# Altium schematic sheet SAMV71_Xplained_Ultra_Power_Multiplexer.SchDoc: Power Multiplexer
size A3; Organization: ATMEL Norway; Address1: Vestre Rosten 79; Address2: N-7075 TILLER; Address3: NORWAY; DocumentNumber: A09-2407; Revision: 11; SheetNumber: 3; SheetTotal: 13; DrawnBy: Microchip Norway; Engineer: AH; PageSetup: Record=PageOptions|CenterHorizontal=True|CenterVertical=True|PrintScale=1.01|XCorrection=1.00|YCorrection=1.00|PrintKind=1|BorderSize=5000000|LeftOffset=0|BottomOffset=0|Orientation=2|PaperLength=1000|PaperWidth=1000|Scale=100|PaperSource=7|PrintQuality=-4|MediaType=1|DitherType=10|PaperKind=A3 (297 x 420 mm)|PrintScaleMode=1; ProjectTitle: SAM V71 Xplained Ultra; PCBNumber: A08-2216; PCBRevision: 4
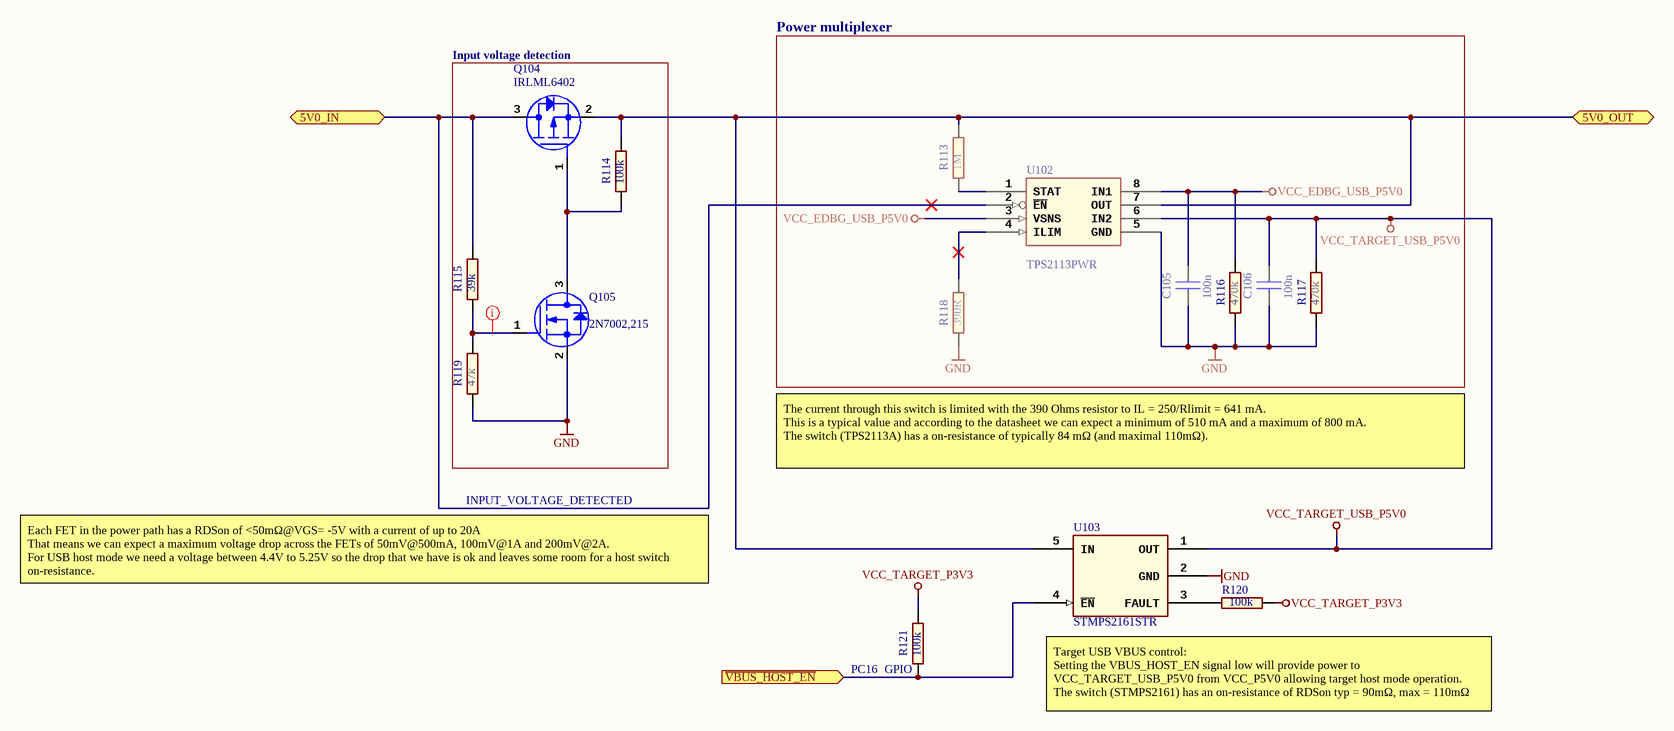
[diagram p0: SAMV71_Xplained_Ultra_Power_Multiplexer.SchDoc]

## Parts
C105  value 100n  [AP1-00001]
C106  value 100n  [AP1-00001]
Q104  value IRLML6402  [AP5-00002]
Q105  value 2N7002,215  [AP5-00002]
R113  value 1M  [AP2-00000]
R114  value 100k  [AP2-00000]
R115  value 39k  [AP2-00000]
R116  value 470k  [AP2-00000]
R117  value 470k  [AP2-00000]
R118  value 390R  [AP2-00000]
R119  value 47k  [AP2-00000]
R120  value 100k  [AP2-00011]
R121  value 100k  [AP2-00011]
U102  value TPS2113PWR  [AP6-00054]
U103  value STMPS2161STR  [AP6-00087]

## Blocks framed on the sheet
Input voltage detection: Q104 Q105 R114 R115 R119
Power multiplexer: C105 C106 R113 R116-R118 U102

## Ports
5V0_IN, 5V0_OUT, ~{VBUS_HOST_EN} (in)

## Nets
GND: C105.2 C106.2 Q105.2(S) R116.1 R117.1 R118.1 R119.1 U102.5(GND) U103.2(GND)
VCC_EDBG_USB_P5V0: C105.1 R116.2 U102.3(VSNS) U102.8(IN1)
VCC_TARGET_P3V3: R120.1 R121.2
VCC_TARGET_USB_P5V0: C106.1 R117.2 U102.6(IN2) U103.1(OUT)
5V0_IN: Q104.3(D) R115.2 U102.2(~{EN}) ; port 5V0_IN
5V0_OUT: Q104.2(S) R113.2 R114.2 U102.7(OUT) U103.5(IN) ; port 5V0_OUT
~{VBUS_HOST_EN}: R121.1 U103.4(~{EN}) ; port ~{VBUS_HOST_EN}
NetQ104_1: Q104.1(G) Q105.3(D) R114.1
NetQ105_1: Q105.1(G) R115.1 R119.2
NetR113_1: R113.1 U102.1(STAT)
NetR118_2: R118.2 U102.4(ILIM)
NetR120_2: R120.2 U103.3(FAULT)

## Layout directives
rule Assembly Testpoint Usage [Testpoint - Not Allowed    Multiple - Not Allowed]; rule Fabrication Testpoint Usage [Testpoint - Not Allowed    Multiple - Not Allowed]: NetQ105_1

## Notes on the sheet
- The current through this switch is limited with the 390 Ohms resistor to IL = 250/Rlimit = 641 mA.
  This is a typical value and according to the datasheet we can expect a minimum of 510 mA and a maximum of 800 mA.
  The switch (TPS2113A) has a on-resistance of typically 84 mΩ (and maximal 110mΩ).
- INPUT_VOLTAGE_DETECTED
- Each FET in the power path has a RDSon of <50mΩ@VGS= -5V with a current of up to 20A
  That means we can expect a maximum voltage drop across the FETs of 50mV@500mA, 100mV@1A and 200mV@2A.
  For USB host mode we need a voltage between 4.4V to 5.25V so the drop that we have is ok and leaves some room for a host switch on-resistance.
- (near R121) PC16
- (near R121) GPIO
- Target USB VBUS control:
  Setting the VBUS_HOST_EN signal low will provide power to VCC_TARGET_USB_P5V0 from VCC_P5V0 allowing target host mode operation.
  The switch (STMPS2161) has an on-resistance of RDSon typ = 90mΩ, max = 110mΩ
- Drawn By:
- Project Title
- Engineer:
- Designed with
- Sheet Title
- Size
- A3
- PCB Number:
- PCB Assembly Number:
- PCBA Revision:
- PCB    Revision:
- Date:
- Altium.com <http://go.altium.com/MicrochipLandingPage_Evaluation.html>
- File:
- Page:

## Library data of the parts
C105 C106 = A01-0246: Ceramic capacitor, SMD 0402, X7R, 16V, +/-10%; PartGroup: Capacitors,Ceramic,SMD 0402; Manufacturer: Kemet; MPN: C0402C104K4RACTU; TemperatureRange: -55 - +125 deg C; Status: Active; AN: A01-0246; Tolerance: 16V, +/-10%; Height: 0,5
Q104 = A05-0087: P-ch. MOSFET. -30V, -3.7A continuous,RDS(ON)=0.05Ohm@VGS=-4,5V, RDS(ON)=0.08Ohm@VGS=-2.5V; PartGroup: Transistors,Power FET,SMD; Manufacturer: International Rectifier; MPN: IRLML6402PBF; TemperatureRange: -55 - +150 deg C; Status: New; AN: A05-0087; Height: 1,14999997615814
Q105 = A05-0085: N-Channel MOSFET. 60V, 0.300A continuous, 1.2A Peak. RDS(ON) = 3.8Ohm@VGS=4.5V, VGS(th)<2.5V; PartGroup: Transistors,Small signal FET,SMD; Manufacturer: NXP; TemperatureRange: -65 to 150 deg C; Status: New; AN: A05-0085; Height: 1,10000002384186; MPN: 2N7002,215
R113 = A02-0284: Thick film resistor, SMD 0402, 1/16W, 1%; PartGroup: Resistors,SMD,0402 1%; Manufacturer: ASJ; MPN: CR10-1004-FK; TemperatureRange: -55 - +125 deg C; Status: Active; AN: A02-0284; Tolerance: 1 %; Height: 0,349999994039536
R114 R120 R121 = A02-0260: Thick film resistor, SMD 0402, 1/16W, 1%; PartGroup: Resistors,SMD,0402 1%; Manufacturer: ASJ; MPN: CR10-1003-FK; TemperatureRange: -55ï¿½ to +125ï¿½C; Status: Active; AN: A02-0260; Tolerance: 1 %; Height: 0,349999994039536
R115 = A02-0250: Thick film resistor, SMD 0402, 1/16W, 1%; PartGroup: Resistors,SMD,0402 1%; Manufacturer: ASJ; MPN: CR10-3902-FK; TemperatureRange: -55 - +125 deg C; Status: Active; AN: A02-0250; Tolerance: 1 %; Height: 0,349999994039536
R116 R117 = A02-0276: Thick film resistor, SMD 0402, 1/16W, 1%; PartGroup: Resistors,SMD,0402 1%; Manufacturer: ASJ; MPN: CR10-4703-FK; TemperatureRange: -55 - +125 deg C; Status: Active; AN: A02-0276; Tolerance: 1 %; Height: 0,349999994039536
R118 = A02-0202: Thick film resistor, SMD 0402, 1/16W, 1%; PartGroup: Resistors,SMD,0402 1%; Manufacturer: ASJ; MPN: CR10-3900-FK; TemperatureRange: -55 - +125 deg C; Status: Active; AN: A02-0202; Tolerance: 1 %; Height: 0,349999994039536
R119 = A02-0252: Thick film resistor, SMD 0402, 1/16W, 1%; PartGroup: Resistors,SMD,0402 1%; Manufacturer: KOA; MPN: RK73H1ETTP4702F; TemperatureRange: -55 - +125 deg C; Status: Active; AN: A02-0252; Tolerance: 1 %; Height: 0,349999994039536
U102 = A06-0068: Autoswitching 2:1 Power Mux; PartGroup: Integrated Circuits,General linear,Analog switch, bus switch and MUX; Manufacturer: Texas Instruments; TemperatureRange: -40 - + 125 deg C; Status: Active; AN: A06-0068; Height: 1,20000004768372; MPN: TPS2113PWR
U103 = A06-1087: Single channel power switch, 1A, reverse block, active low enabled.; PartGroup: Integrated Circuits,General linear,Analog switch, bus switch and MUX; Manufacturer: ST; Tolerance: 2.7 to 5.5V; TemperatureRange: -40Â°C to +85Â°C; Status: *; Design comment: *; AN: A06-1087; Height: 1,45000004768372; MPN: STMPS2161STR